# EAGLE design dipi_tool (EAGLE 7.7.0)
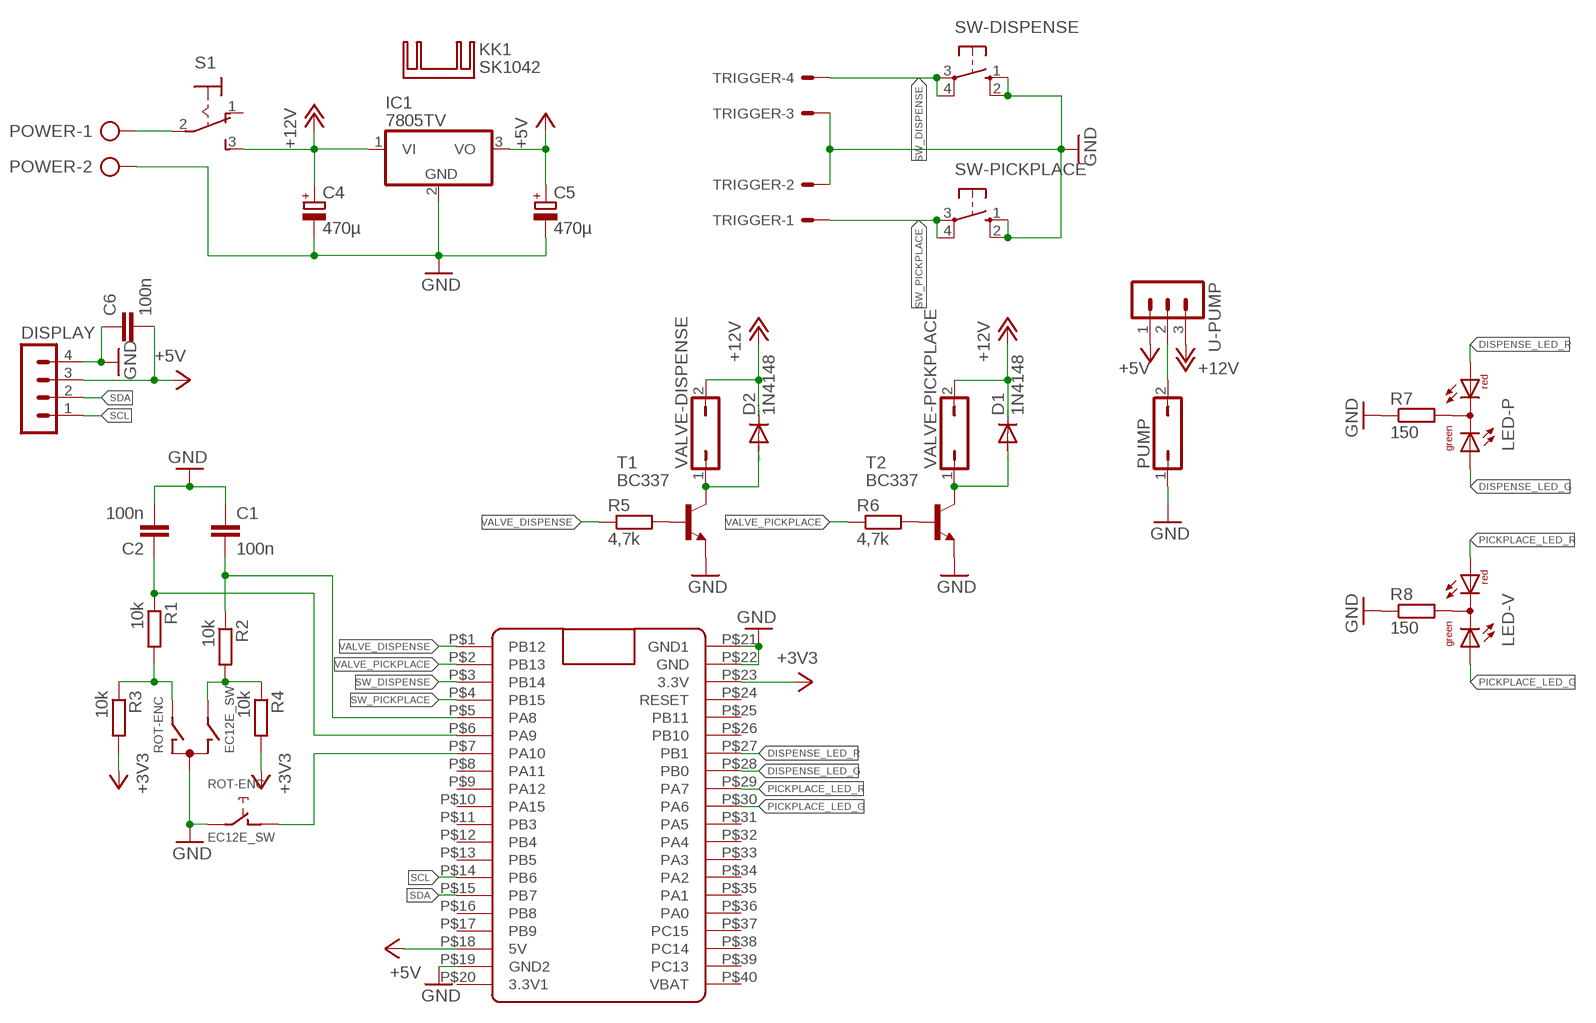
[diagram p0: schematic, sheet 1]

## Parts
C1  100n  C-EUC1206  [C1206]
C2  100n  C-EUC1206  [C1206]
C4  470µ  CPOL-EUE3.5-10  [E3,5-10]
C5  470µ  CPOL-EUE2.5-7  [E2,5-7]
C6  100n  C-EUC1206  [C1206]
D1  1N4148  1N4148DO35-7  [DO35-7]
D2  1N4148  1N4148DO35-7  [DO35-7]
DISPLAY  MA04-1  [MA04-1]
IC1  7805TV  [TO220V]
KK1  SK1042  [CUSTOM1-PAD]
LED-P  DUOLED-RG-C"  [DUOLED-C-3MM]
LED-V  DUOLED-RG-C"  [DUOLED-C-3MM]
POWER  AK500/2  [AK500/2]
PUMP  JP1Q  [JP1]
R1  10k  R-EU_R1206  [R1206]
R2  10k  R-EU_R1206  [R1206]
R3  10k  R-EU_R1206  [R1206]
R4  10k  R-EU_R1206  [R1206]
R5  4,7k  R-EU_0204/2V  [0204V]
R6  4,7k  R-EU_0204/2V  [0204V]
R7  150  R-EU_0204/2V  [0204V]
R8  150  R-EU_0204/2V  [0204V]
ROT-ENC  EC12E_SW  [ALPS_EC12E_SW]
S1  M9040P  [M9040P]
SW-DISPENSE  10-XX  [B3F-10XX]
SW-PICKPLACE  10-XX  [B3F-10XX]
T1  BC337  [TO92]
T2  BC337  [TO92]
TRIGGER  22-27-2041-04  [6410-04]
U$1  BLUE_PILL  [BLUE_PILL]
U-PUMP  MA03-1  [MA03-1]
VALVE-DISPENSE  JP1Q  [JP1]
VALVE-PICKPLACE  JP1Q  [JP1]

## Nets
+3V3: R3.2 R4.2 U$1.P$23(3.3V)
+5V: C5.+ C6.2 DISPLAY.3 IC1.3(VO) U$1.P$18(5V) U-PUMP.1
+12V: C4.+ D1.C D2.C IC1.1(VI) S1.3(S) U-PUMP.3 VALVE-DISPENSE.2 VALVE-PICKPLACE.2
DISPENSE_LED_G: LED-P.1(AG) U$1.P$28(PB0)
DISPENSE_LED_R: LED-P.3(AR) U$1.P$27(PB1)
GND: C1.1 C2.2 C4.- C5.- C6.1 DISPLAY.4 IC1.2(GND) POWER.2 PUMP.1 R7.1 R8.1 ROT-ENC.C ROT-ENC.E SW-DISPENSE.1(S) SW-DISPENSE.2(S1) SW-PICKPLACE.1(S) SW-PICKPLACE.2(S1) T1.1(E) T2.1(E) TRIGGER.2 TRIGGER.3 U$1.P$19(GND2) U$1.P$21(GND1) U$1.P$22(GND)
N$1: R2.2 R4.1 ROT-ENC.B
N$2: R5.2 T1.2(B)
N$3: C2.1 R1.1 U$1.P$6(PA9)
N$4: C1.2 R2.1 U$1.P$5(PA8)
N$5: R1.2 R3.1 ROT-ENC.A
N$6: R6.2 T2.2(B)
N$7: D2.A T1.3(C) VALVE-DISPENSE.1
N$8: ROT-ENC.D U$1.P$7(PA10)
N$9: D1.A T2.3(C) VALVE-PICKPLACE.1
N$10: POWER.1 S1.2(P)
N$11: LED-P.2(C) R7.2
N$12: LED-V.2(C) R8.2
N$13: PUMP.2 U-PUMP.2
PICKPLACE_LED_G: LED-V.1(AG) U$1.P$30(PA6)
PICKPLACE_LED_R: LED-V.3(AR) U$1.P$29(PA7)
SCL: DISPLAY.1 U$1.P$14(PB6)
SDA: DISPLAY.2 U$1.P$15(PB7)
SW_DISPENSE: SW-DISPENSE.3(P) SW-DISPENSE.4(P1) TRIGGER.4 U$1.P$3(PB14)
SW_PICKPLACE: SW-PICKPLACE.3(P) SW-PICKPLACE.4(P1) TRIGGER.1 U$1.P$4(PB15)
VALVE_DISPENSE: R5.1 U$1.P$1(PB12)
VALVE_PICKPLACE: R6.1 U$1.P$2(PB13)
Unconnected: ROT-ENC.GND1(G) ROT-ENC.GND2(G) S1.1(O) U$1.P$8(PA11) U$1.P$9(PA12) U$1.P$10(PA15) U$1.P$11(PB3) U$1.P$12(PB4) U$1.P$13(PB5) U$1.P$16(PB8) U$1.P$17(PB9) U$1.P$20(3.3V1) U$1.P$24(RESET) U$1.P$25(PB11) U$1.P$26(PB10) U$1.P$31(PA5) U$1.P$32(PA4) U$1.P$33(PA3) U$1.P$34(PA2) U$1.P$35(PA1) U$1.P$36(PA0) U$1.P$37(PC15) U$1.P$38(PC14) U$1.P$39(PC13) U$1.P$40(VBAT)

## Library data of the parts
C1 C2 C6 = rcl:C-EU: CAPACITOR, European symbol
C4 C5 = rcl:CPOL-EU: POLARIZED CAPACITOR, European symbol
D1 D2 = diode:1N4148: DIODE high speed (Philips)
DISPLAY = con-lstb:MA04-1: PIN HEADER; OC_FARNELL: unknown; OC_NEWARK: unknown
IC1 = linear:78*: Positive VOLTAGE REGULATOR Source: http://cache.national.com/ds/LM/LM78L05.pdf http://www.fairchildsemi.com/ds/LM/LM7805.pdf
KK1 = heatsink_custom:SK104: HEATSINK manufacturer Fischer/distributor Buerklin
LED-P LED-V = led:DUOLED-RG-C: DUO LED 2 colors (red/green), 5 mm, round, common Cathode www.ligitek.com or other producers.
POWER = con-ptr500:AK500/2: CONNECTOR; OC_FARNELL: unknown; OC_NEWARK: unknown
PUMP VALVE-DISPENSE VALVE-PICKPLACE = jumper:JP1Q: JUMPER
R1-R8 = rcl:R-EU_: RESISTOR, European symbol
ROT-ENC = switch-alps:EC12E_SW: ALPS rotary Encoder EC12E series with switch; MPN: EC12E2424407; OC_FARNELL: 1520813; OC_NEWARK: 74M1068
S1 = switch:M9040P: TOGGLE SWITCH Marquardt
SW-DISPENSE SW-PICKPLACE = switch-omron:10-XX: OMRON SWITCH; LAENGE: 23mm; MPN: B3F-1000; OC_FARNELL: 176432; OC_NEWARK: 36M3542
T1 T2 = transistor:BC337: NPN TRANSISTOR
TRIGGER = con-molex:22-?-04: CONNECTOR wire to board 2.54 mm (.1 inch) pitch header; OC_FARNELL: unknown; OC_NEWARK: unknown
U$1 = BluePill:BLUE_PILL
U-PUMP = con-lstb:MA03-1: PIN HEADER; OC_FARNELL: unknown; OC_NEWARK: unknown

## Board
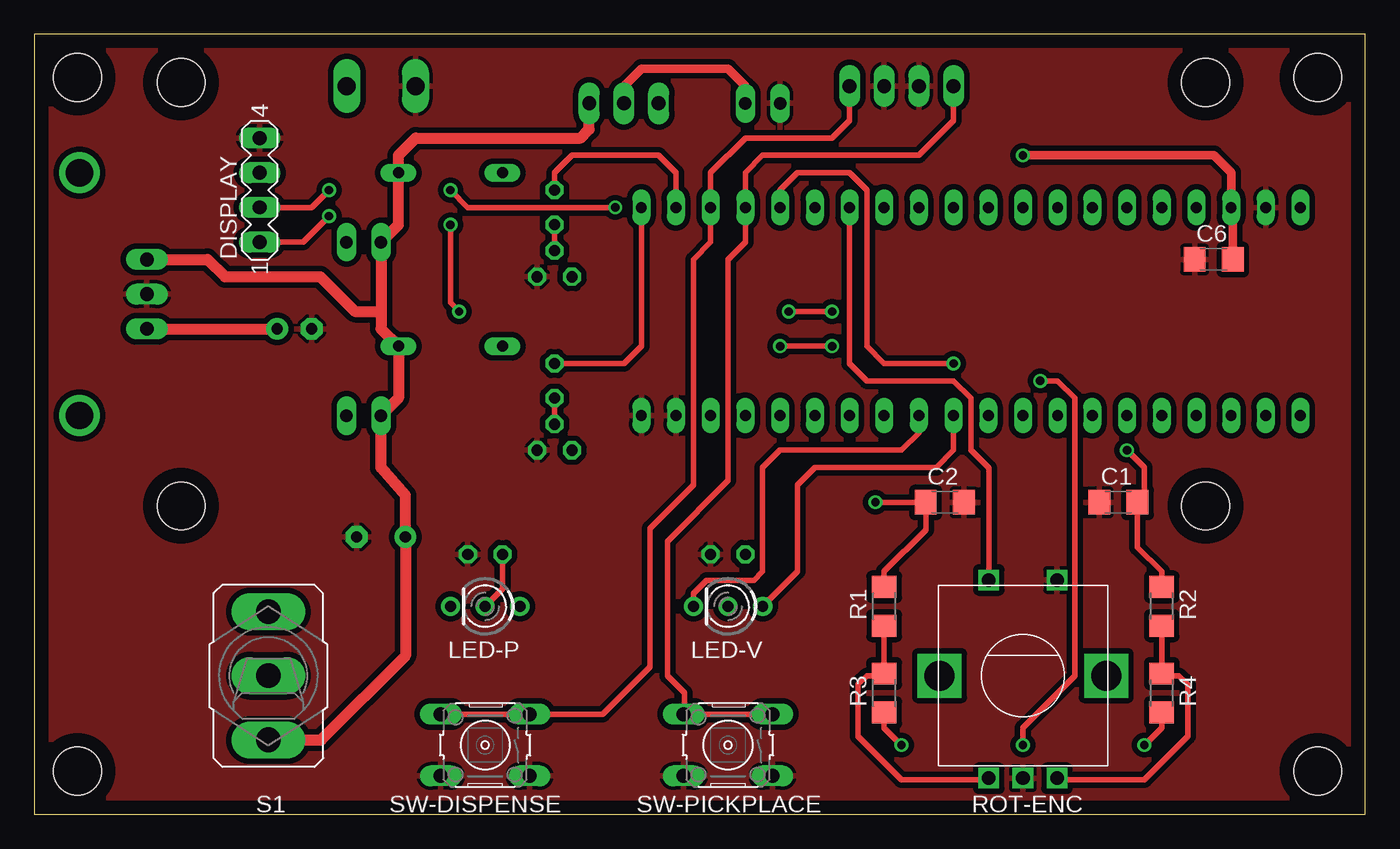
[diagram p1: board, top side]
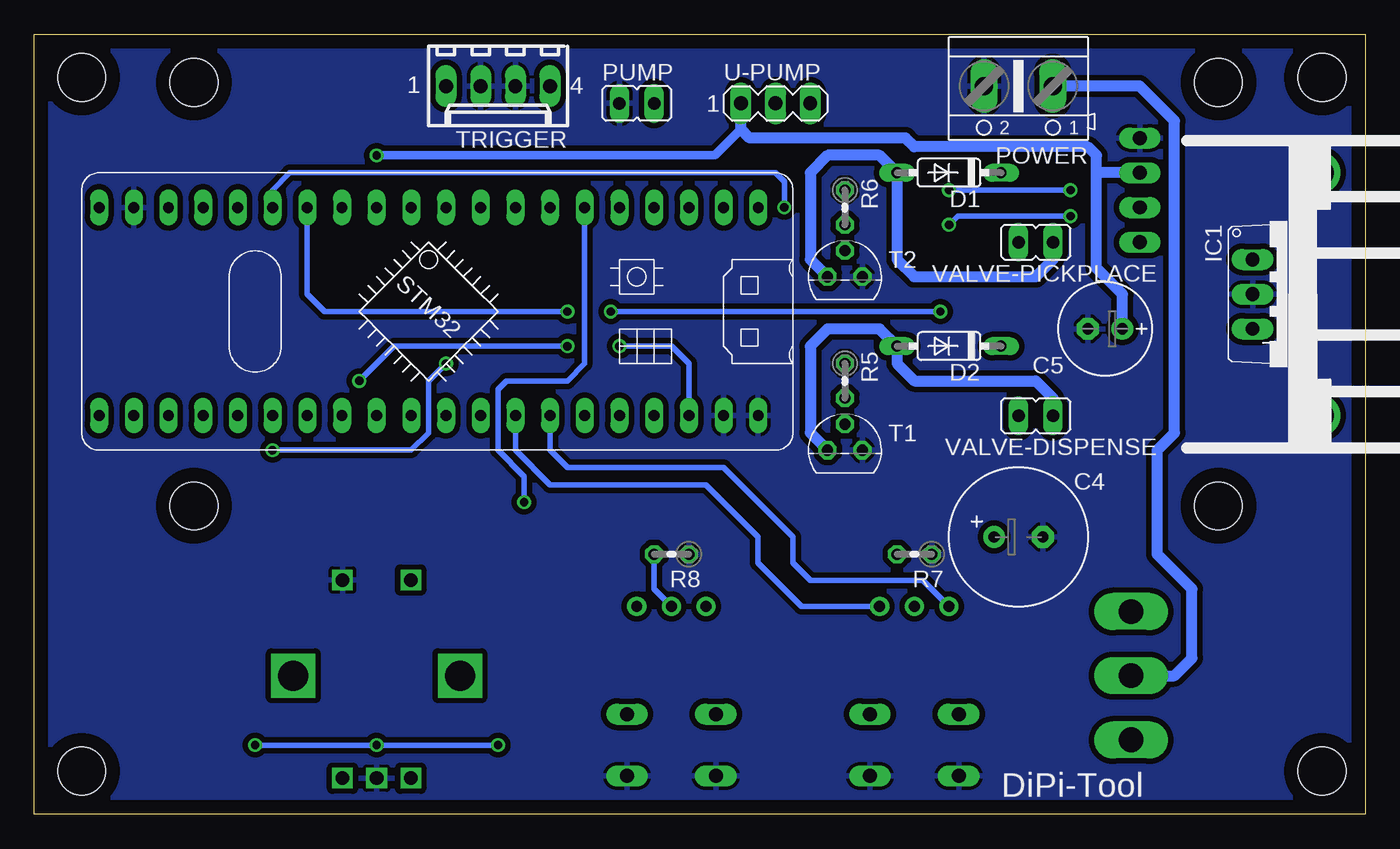
[diagram p2: board, bottom side, seen from below]

Size 97.46 x 57.14 mm. Coordinates in mm from the lower left corner, seen from the top.
Outline: 0,0 97.46,0 97.46,57.14 0,57.14 0,0
Copper layers (1*16): Top 0.035mm / dielectric 1.5mm / Bottom 0.035mm
Design rules "default": minimum track width 10mil, minimum drill 24mil, track to track 8mil, track to pad 8mil, pad to pad 8mil, via to via 8mil, smd to smd 8mil, copper to edge 40mil, drill to drill 8mil, minimum pad ring 10mil, minimum via ring 8mil, stop-mask expansion 4mil, vias tented up to drill 0mil, thermal gap 10mil
Holes 3.5 mm at 3.17,53.98 3.17,3.17 93.98,53.98 93.98,3.17 10.76,53.6 10.76,22.6 85.76,53.6 85.76,22.6

### Footprints (pad centres in the part's own frame; a part is rotated, then mirrored left to right if it is on the bottom)
C1206 = smd 1.6 x 1.8: 1 -1.4,0; 2 1.4,0
E3,5-10 = drill 0.813 pad 1.6: + -1.778,0 | drill 0.813 pad 1.6 octagon: - 1.778,0
E2,5-7 = drill 0.813 pad 1.6: + -1.27,0 | drill 0.813 pad 1.6 octagon: - 1.27,0
DO35-7 = drill 0.813 long: A 3.81,0; C -3.81,0
MA04-1 = drill 1.016 long: 1 -3.81,0; 2 -1.27,0; 3 1.27,0; 4 3.81,0
TO220V = drill 1.016 long: 1 -2.54,-2.54; 2 0,-2.54; 3 2.54,-2.54
CUSTOM1-PAD = drill 2: P$1 -8.89,-0.492; P$2 8.89,-0.492
DUOLED-C-3MM = drill 0.8 pad 1.4: 1 -2.54,0; 2 0,0; 3 2.54,0
AK500/2 = drill 1.321 long: 1 -2.515,0; 2 2.515,0
JP1 = drill 0.914 long: 1 0,-1.27; 2 0,1.27
R1206 = smd 1.6 x 1.803: 1 -1.422,0; 2 1.422,0
0204V = drill 0.813 octagon: 1 -1.27,0; 2 1.27,0
ALPS_EC12E_SW = drill 1 square: A -2.5,-7.5; B 2.5,-7.5; C 0,-7.5; D -2.5,7; E 2.5,7 | drill 2.2 square: GND1 -6.1,0; GND2 6.1,0
M9040P = drill 1.803 long: 1 0,4.699; 2 0,0; 3 0,-4.699
B3F-10XX = drill 1.016 long: 1 -3.251,2.261; 2 3.251,2.261; 3 -3.251,-2.261; 4 3.251,-2.261
TO92 = drill 0.813 octagon: 1 1.27,0; 2 0,1.905; 3 -1.27,0
6410-04 = drill 1.016 long: 1 3.81,0; 2 1.27,0; 3 -1.27,0; 4 -3.81,0
BLUE_PILL = drill 0.8 long: P$1 -7.62,15.24; P$2 -7.62,12.7; P$3 -7.62,10.16; P$4 -7.62,7.62; P$5 -7.62,5.08; P$6 -7.62,2.54; P$7 -7.62,0; P$8 -7.62,-2.54; P$9 -7.62,-5.08; P$10 -7.62,-7.62; P$11 -7.62,-10.16; P$12 -7.62,-12.7; P$13 -7.62,-15.24; P$14 -7.62,-17.78; P$15 -7.62,-20.32; P$16 -7.62,-22.86; P$17 -7.62,-25.4; P$18 -7.62,-27.94; P$19 -7.62,-30.48; P$20 -7.62,-33.02; P$21 7.62,15.24; P$22 7.62,12.7; P$23 7.62,10.16; P$24 7.62,7.62; P$25 7.62,5.08; P$26 7.62,2.54; P$27 7.62,0; P$28 7.62,-2.54; P$29 7.62,-5.08; P$30 7.62,-7.62; P$31 7.62,-10.16; P$32 7.62,-12.7; P$33 7.62,-15.24; P$34 7.62,-17.78; P$35 7.62,-20.32; P$36 7.62,-22.86; P$37 7.62,-25.4; P$38 7.62,-27.94; P$39 7.62,-30.48; P$40 7.62,-33.02
MA03-1 = drill 1.016 long: 1 -2.54,0; 2 0,0; 3 2.54,0

### Placement (x,y rotation side)
C1  79.38,22.86 0 top
C2  66.67,22.86 0 top
C4  25.4,20.32 0 bottom
C5  19.05,35.56 180 bottom
C6  86.36,40.64 0 top
D1  30.48,46.99 180 bottom
D2  30.48,34.29 180 bottom
DISPLAY  16.51,45.72 90 top
IC1  5.71,38.1 270 bottom
KK1  3.81,38.1 90 bottom
LED-P  33.02,15.24 180 top
LED-V  50.8,15.24 180 top
POWER  25.4,53.34 180 bottom
PUMP  53.34,52.07 270 bottom
R1  62.23,15.24 270 top
R2  82.55,15.24 270 top
R3  62.23,8.89 270 top
R4  82.55,8.89 270 top
R5  38.1,31.75 270 bottom
R6  38.1,44.45 270 bottom
R7  33.02,19.05 180 bottom
R8  50.8,19.05 180 bottom
ROT-ENC  72.39,10.16 0 top
S1  17.14,10.16 0 top
SW-DISPENSE  33.02,5.08 180 top
SW-PICKPLACE  50.8,5.08 180 top
T1  38.1,26.67 0 bottom
T2  38.1,39.37 0 bottom
TRIGGER  63.5,53.34 180 bottom
U$1  59.69,36.83 270 bottom
U-PUMP  43.18,52.07 0 bottom
VALVE-DISPENSE  24.13,29.21 90 bottom
VALVE-PICKPLACE  24.13,41.91 90 bottom

### Tracks (layer width: path | path; a pad name or v marks a point on that pad's centre or on a via)
+3V3  (via drill 0.61)
  Top 0.406: v54.61,34.29 v58.42,34.29 | v73.66,31.75 74.93,31.75 76.2,30.48 76.2,10.16 72.39,6.35 v72.39,5.08 | R3.2 62.23,6.35 v63.5,5.08 | R4.2 82.55,6.35 v81.28,5.08
  Bottom 0.406: U$1.P$23 49.53,33.02 50.8,34.29 v54.61,34.29 | v58.42,34.29 71.12,34.29 v73.66,31.75 | v63.5,5.08 v72.39,5.08 v81.28,5.08
+5V  (via drill 0.61)
  Top 0.61: C6.2 87.76,44.32 U$1.P$18 87.63,46.99 86.36,48.26 v72.39,48.26
  Top 0.813: IC1.3 C5.+
  Bottom 0.61: v72.39,48.26 47.62,48.26 45.72,50.16
  Bottom 0.813: U-PUMP.1 45.72,50.16 45.09,49.53 33.66,49.53 33.02,48.9 20.32,48.9 19.68,48.26 19.68,46.99 | 19.68,46.99 19.68,40.01 17.78,38.1 C5.+ | DISPLAY.3 19.68,46.99
+12V
  Top 0.813: 25.4,36.83 VALVE-PICKPLACE.2 26.67,43.18 D1.C 26.67,48.26 27.94,49.53 40.01,49.53 40.64,50.16 U-PUMP.3 | 25.4,36.83 25.4,35.56 D2.C 26.67,30.48 VALVE-DISPENSE.2 25.4,25.4 27.18,23.37 C4.+ 27.18,11.62 21.02,5.46 S1.3 | 25.4,36.83 23.5,36.83 20.95,39.37 13.97,39.37 12.7,40.64 IC1.1
DISPENSE_LED_G
  Bottom 0.406: LED-P.1 41.27,15.24 44.45,18.41 44.45,20.32 48.26,24.13 59.69,24.13 62.23,26.67 U$1.P$28
DISPENSE_LED_R
  Bottom 0.406: LED-P.3 32.38,17.14 40.64,17.14 41.91,18.41 41.91,20.32 46.99,25.4 58.42,25.4 59.69,26.67 U$1.P$27
GND
  pour Top (isolate 0.4): -2.54,58.42 -2.54,0 99.06,0 99.06,58.42
  pour Bottom (isolate 0.4): -1.27,59.69 -1.27,-1.27 97.79,-1.27 97.79,59.69
N$1
  Top 0.406: R2.2 R4.1 82.4,10.16 83.82,10.16 84.45,9.53 84.45,5.71 81.28,2.54 75.01,2.54 ROT-ENC.B
N$2
  Top 0.406: R5.2 T1.2
N$3  (via drill 0.61)
  Top 0.406: v61.59,22.86 C2.1 65.28,20.82 62.23,17.78 R1.1
  Bottom 0.406: U$1.P$6 57.15,33.02 58.42,31.75 62.87,31.75 63.5,31.11 63.5,26.67 61.59,24.77 v61.59,22.86
N$4  (via drill 0.61)
  Top 0.406: v67.31,33.02 62.23,33.02 60.96,34.29 60.96,45.72 59.69,46.99 55.88,46.99 54.61,45.72 U$1.P$5 | R2.1 82.55,17.78 80.78,19.55 C1.2 81.28,23.31 81.28,25.4 v80.01,26.67
  Bottom 0.406: v67.31,33.02 68.58,31.75 68.58,27.94 69.85,26.67 78.74,26.67 v80.01,26.67
N$5
  Top 0.406: R1.2 R3.1 62.38,10.16 60.96,10.16 60.33,9.53 60.33,5.71 63.5,2.54 69.77,2.54 ROT-ENC.A
N$6
  Top 0.406: R6.2 T2.2
N$7
  Bottom 0.813: T1.3 40.64,27.94 40.64,34.29 39.37,35.56 35.56,35.56 D2.A 34.29,33.02 33.02,31.75 24.13,31.75 22.86,30.48 VALVE-DISPENSE.1
N$8
  Top 0.406: ROT-ENC.D 69.89,25.36 68.58,26.67 68.58,30.48 67.31,31.75 60.96,31.75 59.69,33.02 U$1.P$7
N$9
  Bottom 0.813: T2.3 40.64,40.64 40.64,46.99 39.37,48.26 35.56,48.26 D1.A 34.29,40.64 33.02,39.37 24.13,39.37 22.86,40.64 VALVE-PICKPLACE.1
N$10
  Bottom 0.813: POWER.1 16.51,53.34 13.97,50.8 13.97,27.94 15.24,26.67 15.24,19.05 12.7,16.51 12.7,11.43 13.97,10.16 S1.2
N$11
  Top 0.406: R7.2 34.29,16.51 LED-P.2
N$12
  Bottom 0.406: R8.2 52.07,16.51 LED-V.2
N$13
  Top 0.61: PUMP.2 52.07,53.34 50.8,54.61 44.45,54.61 43.18,53.34 U-PUMP.2
PICKPLACE_LED_G
  Top 0.406: U$1.P$30 67.31,26.67 66.04,25.4 57.15,25.4 55.88,24.13 55.88,17.78 LED-V.1
PICKPLACE_LED_R
  Top 0.406: LED-V.3 48.26,16.19 49.21,17.14 52.7,17.14 53.34,17.78 53.34,25.4 54.61,26.67 63.5,26.67 64.77,27.94 U$1.P$29
SCL  (via drill 0.61)
  Top 0.406: v21.59,43.81 19.68,41.91 DISPLAY.1 | v55.24,36.83 v58.42,36.83 | v30.48,43.18 30.48,37.47 v31.11,36.83
  Bottom 0.406: v31.11,36.83 v55.24,36.83 | v58.42,36.83 76.2,36.83 77.47,38.1 U$1.P$14 | v21.59,43.81 29.84,43.81 v30.48,43.18
SDA  (via drill 0.61)
  Top 0.406: v21.59,45.72 20.32,44.45 DISPLAY.2 | v30.48,45.72 31.75,44.45 v42.55,44.45
  Bottom 0.406: v21.59,45.72 v30.48,45.72 | v42.55,44.45 42.55,46.35 43.18,46.99 78.74,46.99 80.01,45.72 U$1.P$15
SW_DISPENSE
  Top 0.406: TRIGGER.4 59.69,50.8 58.42,49.53 52.07,49.53 49.53,46.99 U$1.P$3 49.53,41.91 48.26,40.64 48.26,24.13 45.09,20.95 45.09,10.79 41.63,7.34 SW-DISPENSE.3 SW-DISPENSE.4
SW_PICKPLACE
  Top 0.406: TRIGGER.1 67.31,50.8 64.77,48.26 53.34,48.26 52.07,46.99 U$1.P$4 52.07,41.91 50.8,40.64 50.8,24.45 46.35,20 46.35,10.16 47.62,8.89 47.62,7.42 SW-PICKPLACE.4 SW-PICKPLACE.3
VALVE_DISPENSE
  Top 0.406: U$1.P$1 44.45,34.29 43.18,33.02 R5.1
VALVE_PICKPLACE
  Top 0.406: R6.1 38.1,46.99 39.37,48.26 45.72,48.26 46.99,46.99 U$1.P$2

### Text on the board
bNames: DiPi-Tool